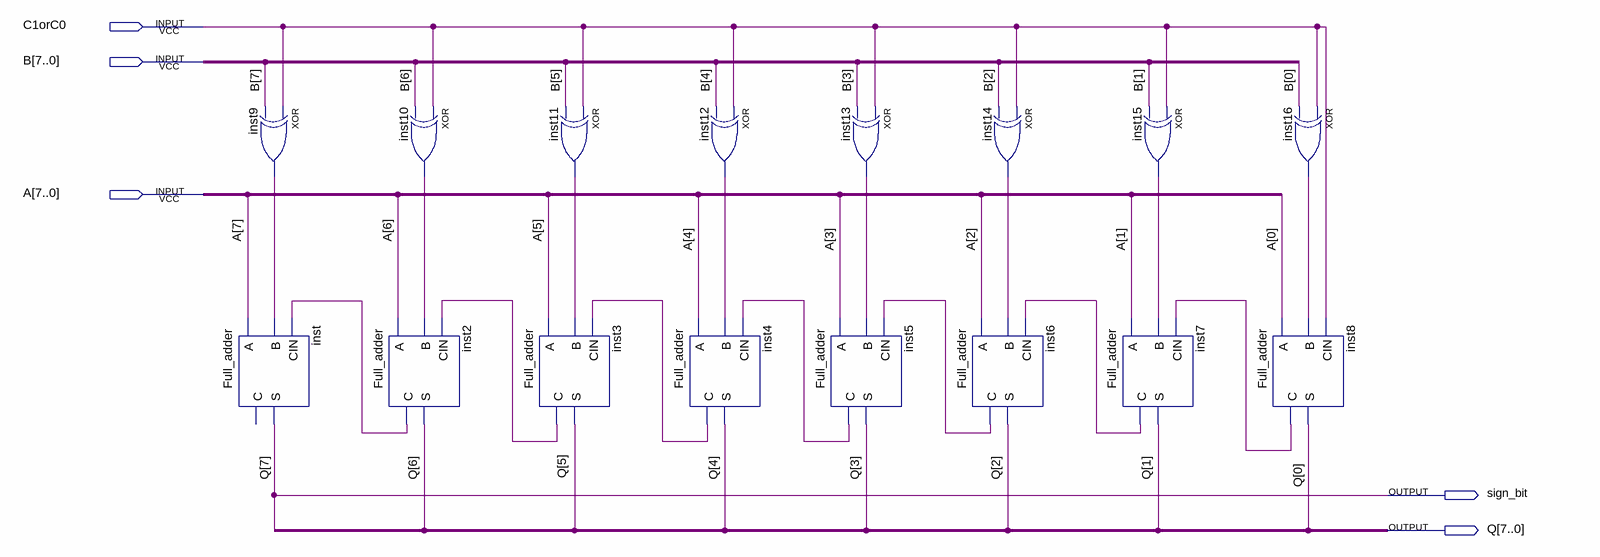
[diagram p0: schematic sheet]
// Quartus schematic ADD_or_SUB_MODULE.bdf as structural Verilog: 16 symbols, 5 pins
module ADD_or_SUB_MODULE (
  input  C1orC0,
  input  [7:0] B,
  input  [7:0] A,
  output sign_bit,
  output [7:0] Q
);

  wire inst2_c, inst3_c, inst4_c, inst5_c, inst6_c, inst7_c, inst8_c, inst9_out, inst10_out, inst11_out,
       inst12_out, inst13_out, inst14_out, inst15_out, inst16_out;

  xor inst9 (inst9_out, C1orC0, B[7]);
  Full_adder inst (.A(A[7]), .B(inst9_out), .CIN(inst2_c), .S(Q[7]));  // open: C
  Full_adder inst2 (.A(A[6]), .B(inst10_out), .CIN(inst3_c), .S(Q[6]), .C(inst2_c));
  xor inst10 (inst10_out, C1orC0, B[6]);
  Full_adder inst3 (.A(A[5]), .B(inst11_out), .CIN(inst4_c), .S(Q[5]), .C(inst3_c));
  xor inst11 (inst11_out, C1orC0, B[5]);
  Full_adder inst4 (.A(A[4]), .B(inst12_out), .CIN(inst5_c), .S(Q[4]), .C(inst4_c));
  xor inst12 (inst12_out, C1orC0, B[4]);
  Full_adder inst5 (.A(A[3]), .B(inst13_out), .CIN(inst6_c), .S(Q[3]), .C(inst5_c));
  xor inst13 (inst13_out, C1orC0, B[3]);
  Full_adder inst6 (.A(A[2]), .B(inst14_out), .CIN(inst7_c), .S(Q[2]), .C(inst6_c));
  xor inst14 (inst14_out, C1orC0, B[2]);
  xor inst15 (inst15_out, C1orC0, B[1]);
  Full_adder inst7 (.A(A[1]), .B(inst15_out), .CIN(inst8_c), .S(Q[1]), .C(inst7_c));
  xor inst16 (inst16_out, C1orC0, B[0]);
  Full_adder inst8 (.A(A[0]), .B(inst16_out), .CIN(C1orC0), .S(Q[0]), .C(inst8_c));

  assign sign_bit = Q[7];
endmodule
